# Altium schematic sheet pkq.SchDoc
size A4; DocumentNumber: 1; SheetNumber: 1; SheetTotal: 1
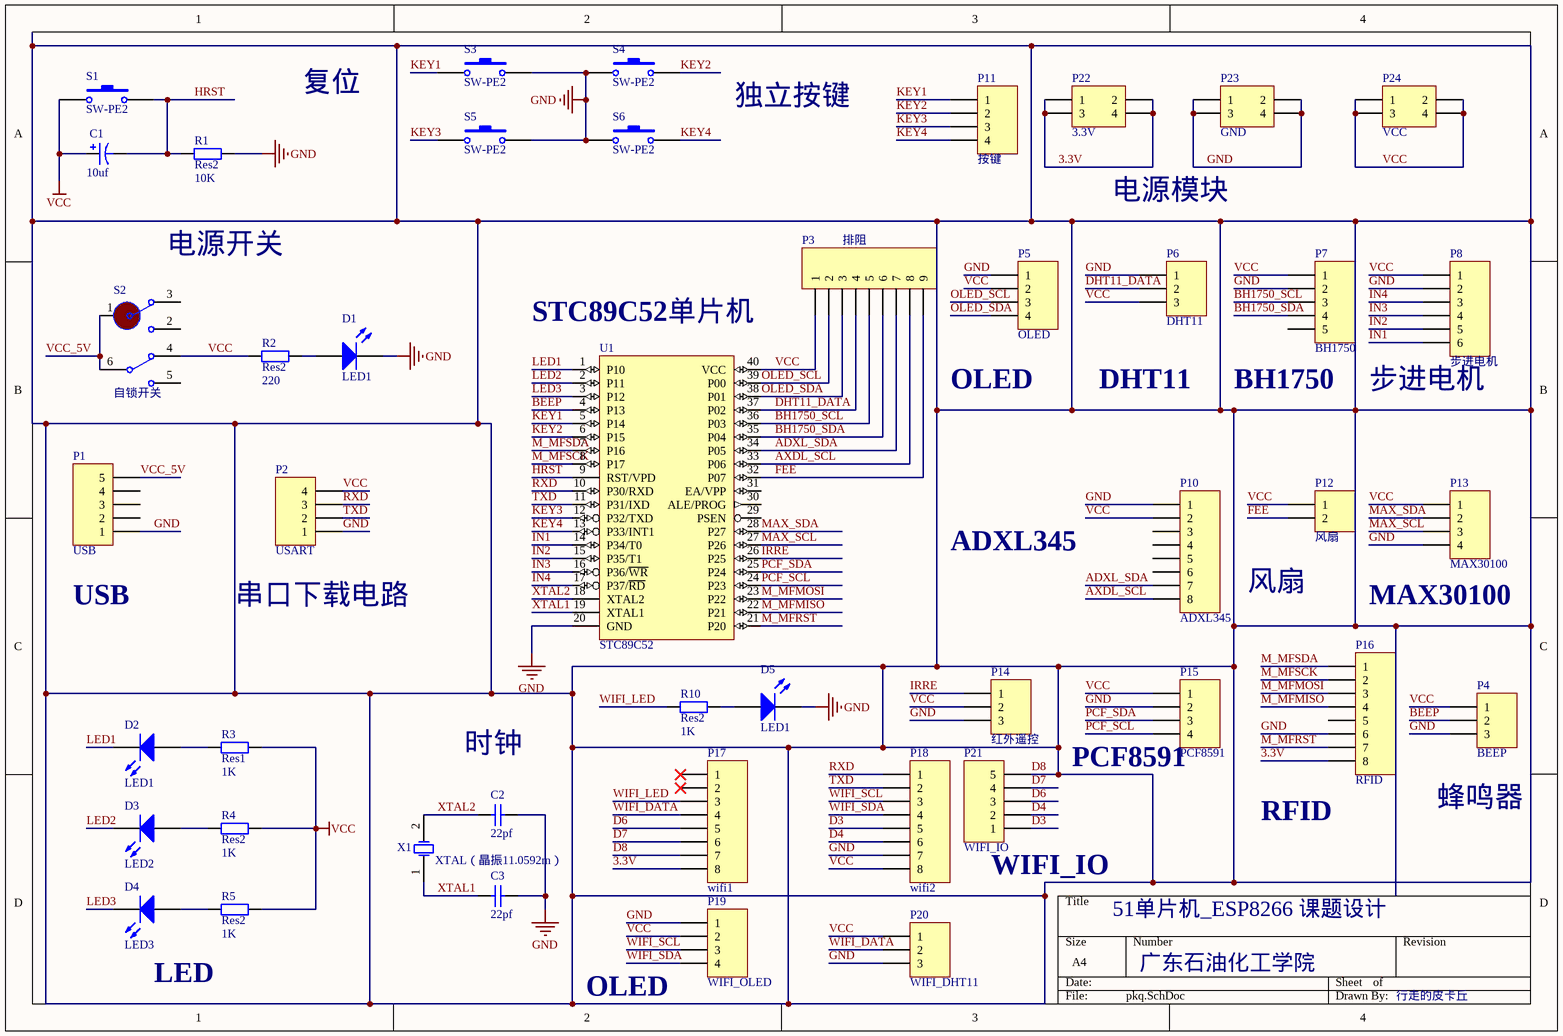
[diagram p0: pkq.SchDoc]

## Parts
C1  10uf  [电解电容]
C2  22pf  [瓷片电容]
C3  22pf  [瓷片电容]
D1  LED1  [LED-1]
D2  LED1  [LED-0]
D3  LED2  [LED-0]
D4  LED3  [LED-0]
D5  LED1  [LED-1]
P1  USB  [HDR1X5]
P2  USART  [HDR1X4]
P3  排阻  [ResPack9]
P4  BEEP  [HDR1X3]
P5  OLED  [HDR1X4]
P6  DHT11  [HDR1X3]
P7  BH1750  [HDR1X5]
P8  步进电机  [HDR1X6]
P10  ADXL345  [HDR1X8]
P11  按键  [HDR1X4]
P12  风扇  [HDR1X2]
P13  MAX30100  [HDR1X4]
P14  红外遥控  [HDR1X3]
P15  PCF8591  [HDR1X4]
P16  RFID  [HDR1X8]
P17  wifi1  [HDR1X8]
P18  wifi2  [HDR1X8]
P19  WIFI_OLED  [HDR1X4]
P20  WIFI_DHT11  [HDR1X3]
P21  WIFI_IO  [HDR1X5]
P22  3.3V  [HDR2X2]
P23  GND  [HDR2X2]
P24  VCC  [HDR2X2]
R1  Res2  value 10K  [AXIAL-0.4]
R2  Res2  value 220  [AXIAL-0.4]
R3  Res1  value 1K  [AXIAL-0.4]
R4  Res2  value 1K  [AXIAL-0.4]
R5  Res2  value 1K  [AXIAL-0.4]
R10  Res2  value 1K  [AXIAL-0.4]
S1  SW-PE2  [KEYTOUCH]
S2  自锁开关  [自锁开关]
S3  SW-PE2  [KEYTOUCH]
S4  SW-PE2  [KEYTOUCH]
S5  SW-PE2  [KEYTOUCH]
S6  SW-PE2  [KEYTOUCH]
U1  STC89C52  [DIP40]
X1  XTAL（晶振11.0592m）  [XTAL]

## Nets
GND: C2.2 C3.2 D1.2(K) D5.2(K) P1.1 P2.1 P4.3 P5.1 P6.1 P7.2 P8.2 P10.1 P13.4 P14.3 P15.2 P16.6 P18.7 P19.1 P20.3 P23.1 P23.2 P23.3 P23.4 R1.2 S3.2 S4.1 S5.2 S6.1 U1.20(GND)
VCC: C1.1 P2.4 P3.1 P4.1 P5.2 P6.3 P7.1 P8.1 P10.2 P12.1 P13.1 P14.2 P15.1 P18.8 P19.2 P20.1 P24.1 P24.2 P24.3 P24.4 R2.1 R3.2 R4.2 R5.2 S1.1 S2.4 U1.40(VCC)
3.3V: P16.8 P17.8 P22.1 P22.2 P22.3 P22.4
ADXL_SDA: P3.7 P10.7 U1.34(P05)
AXDL_SCL: P3.8 P10.8 U1.33(P06)
BEEP: P4.2 U1.4(P13)
BH1750_SCL: P3.5 P7.3 U1.36(P03)
BH1750_SDA: P3.6 P7.4 U1.35(P04)
D3: P18.5 P21.1
D4: P18.6 P21.2
D6: P17.5 P21.3
D7: P17.6 P21.4
D8: P17.7 P21.5
DHT11_DATA: P3.4 P6.2 U1.37(P02)
FEE: P3.9 P12.2 U1.32(P07)
HRST: C1.2 R1.1 S1.2 U1.9(RST/VPD)
IN1: P8.6 U1.14(P34/T0)
IN2: P8.5 U1.15(P35/T1)
IN3: P8.4 U1.16(P36/~{WR})
IN4: P8.3 U1.17(P37/~{RD})
IRRE: P14.1 U1.26(P25)
KEY1: P11.1 S3.1 U1.5(P14)
KEY2: P11.2 S4.2 U1.6(P15)
KEY3: P11.3 S5.1 U1.12(P32/TXD)
KEY4: P11.4 S6.2 U1.13(P33/INT1)
LED1: D2.2(K) U1.1(P10)
LED2: D3.2(K) U1.2(P11)
LED3: D4.2(K) U1.3(P12)
M_MFMISO: P16.4 U1.22(P21)
M_MFMOSI: P16.3 U1.23(P22)
M_MFRST: P16.7 U1.21(P20)
M_MFSCK: P16.2 U1.8(P17)
M_MFSDA: P16.1 U1.7(P16)
MAX_SCL: P13.3 U1.27(P26)
MAX_SDA: P13.2 U1.28(P27)
OLED_SCL: P3.2 P5.3 U1.39(P00)
OLED_SDA: P3.3 P5.4 U1.38(P01)
PCF_SCL: P15.4 U1.24(P23)
PCF_SDA: P15.3 U1.25(P24)
RXD: P2.3 P18.1 U1.10(P30/RXD)
TXD: P2.2 P18.2 U1.11(P31/IXD)
VCC_5V: P1.5 S2.1 S2.6
WIFI_DATA: P17.4 P20.2
WIFI_LED: P17.3 R10.1
WIFI_SCL: P18.3 P19.3
WIFI_SDA: P18.4 P19.4
XTAL1: C3.1 U1.19(XTAL1) X1.1(OSC1)
XTAL2: C2.1 U1.18(XTAL2) X1.2(OSC2)
NetD1_1: D1.1(A) R2.2
NetD2_1: D2.1(A) R3.1
NetD3_1: D3.1(A) R4.1
NetD4_1: D4.1(A) R5.1
NetD5_1: D5.1(A) R10.2

Not connected (* = marked no-connect by the designer): P1 2 3 4; P7 5; P10 3 4 5 6; P16 5; P17 1* 2*; S2 2 3 5; U1 29(PSEN) 30(ALE/PROG) 31(EA/VPP)

## Notes on the sheet
- 复位
- 独立按键
- 电源模块
- (near S2) 电源开关
- (near U1) STC89C52单片机
- (near P5) OLED
- DHT11
- (near P7) BH1750
- (near P8) 步进电机
- ADXL345
- (near P1) USB
- (near P2) 串口下载电路
- 风扇
- MAX30100
- 时钟
- (near P15) PCF8591
- (near P16) RFID
- (near P4) 蜂鸣器
- (near P21) WIFI_IO
- 51单片机_ESP8266 课题设计
- LED
- 广东石油化工学院
- OLED
- 行走的皮卡丘

## Library data of the parts
C1 = 电解电容
C2 C3 = 瓷片电容
D1 D5 = LED1: Typical RED GaAs LED; Published: 8-Jun-2000; LatestRevisionDate: 08-Jul-2005; LatestRevisionNote: Mech Layer 1 removed.; PackageReference: LED-1; Publisher: Altium Limited
D2-D4 = LED0: Typical INFRARED GaAs LED; Published: 8-Jun-2000; LatestRevisionDate: 08-Jul-2005; LatestRevisionNote: Mech Layer 1 removed.; PackageReference: LED-0; Publisher: Altium Limited; PackageDescription: LED; 2 Leads
P1 P7 P21 = Header 5: Header, 5-Pin; LatestRevisionDate: 17-Jul-2002; LatestRevisionNote: Re-released for DXP Platform.; Publisher: Altium Limited
P2 P5 P11 P13 P15 P19 = Header 4: Header, 4-Pin; LatestRevisionDate: 17-Jul-2002; LatestRevisionNote: Re-released for DXP Platform.; Publisher: Altium Limited
P3 = Res Pack9
P4 P6 P14 P20 = Header 3: Header, 3-Pin; LatestRevisionDate: 17-Jul-2002; LatestRevisionNote: Re-released for DXP Platform.; Publisher: Altium Limited
P8 = Header 6: Header, 6-Pin; LatestRevisionDate: 17-Jul-2002; LatestRevisionNote: Re-released for DXP Platform.; Publisher: Altium Limited
P10 P16-P18 = Header 8: Header, 8-Pin; LatestRevisionDate: 17-Jul-2002; LatestRevisionNote: Re-released for DXP Platform.; Publisher: Altium Limited
P12 = Header 2: Header, 2-Pin; LatestRevisionDate: 17-Jul-2002; LatestRevisionNote: Re-released for DXP Platform.; Publisher: Altium Limited
P22-P24 = Header 2X2: Header, 2-Pin, Dual row; LatestRevisionDate: 17-Jul-2002; LatestRevisionNote: Re-released for DXP Platform.; Publisher: Altium Limited
R1-R5 R10 = Res2: Resistor; Published: 8-Jun-2000; LatestRevisionDate: 17-Jul-2002; LatestRevisionNote: Re-released for DXP Platform.; PackageReference: AXIAL-0.4; Publisher: Altium Limited; PackageDescription: Axial Device, Thru-Hole; 2 Leads; 0.4 in Pin Spacing
X1 = XTAL（晶振）